# Altium schematic sheet BLOCK_DIAGRAM.SchDoc
size A; SheetNumber: 1; SheetTotal: 4
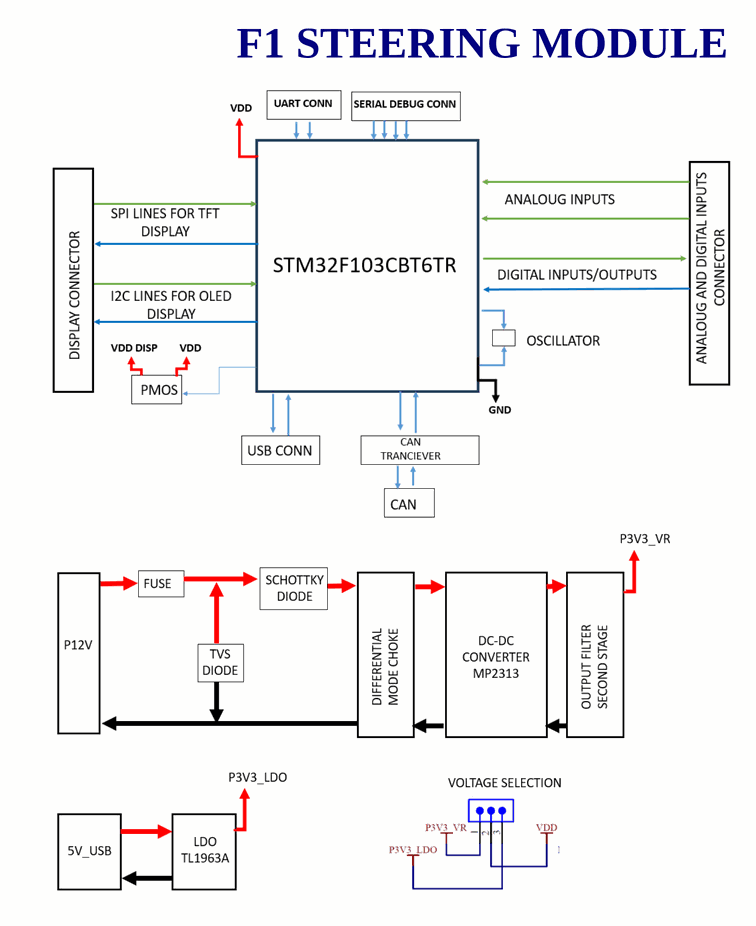
[diagram p0: BLOCK_DIAGRAM.SchDoc]

## Notes on the sheet
- F1 STEERING MODULE